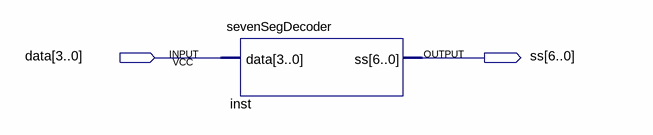
[diagram p0: schematic sheet]
// Quartus schematic testSevenSegDecoder.bdf as structural Verilog: 1 symbols, 2 pins
module testSevenSegDecoder (
  input  [3:0] data,
  output [6:0] ss
);

  sevenSegDecoder inst (.data(data), .ss(ss));
endmodule
